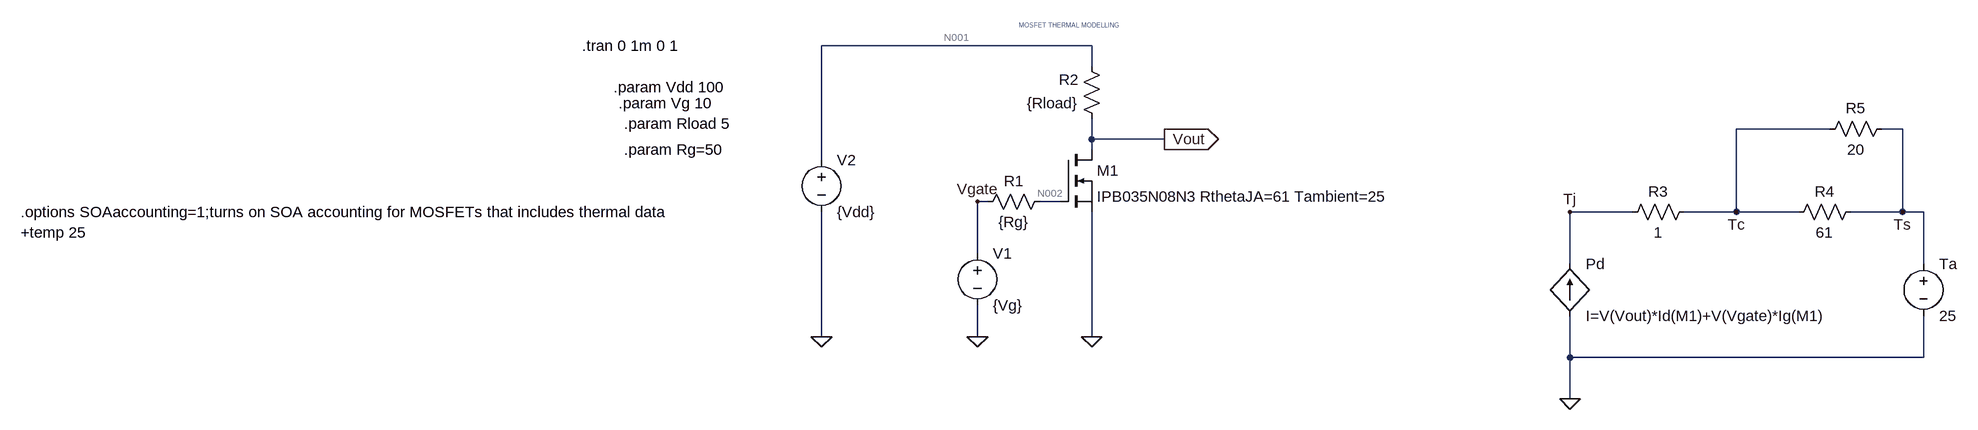
[diagram p0: schematic Thermal.asc]
Thermal.asc, the LTspice schematic file:
Version 4.1
SHEET 1 1416 680
WIRE 80 -48 -336 -48
WIRE 80 -16 80 -48
WIRE 1216 80 1072 80
WIRE 1328 80 1296 80
WIRE 80 96 80 64
WIRE 192 96 80 96
WIRE 80 112 80 96
WIRE -336 128 -336 -48
WIRE -80 192 -96 192
WIRE 32 192 0 192
WIRE 912 208 816 208
WIRE 1072 208 1072 80
WIRE 1072 208 992 208
WIRE 1168 208 1072 208
WIRE 1328 208 1328 80
WIRE 1328 208 1248 208
WIRE 1360 208 1328 208
WIRE -96 272 -96 192
WIRE 816 288 816 208
WIRE 1360 288 1360 208
WIRE -336 400 -336 208
WIRE -96 400 -96 352
WIRE 80 400 80 208
WIRE 816 432 816 368
WIRE 1360 432 1360 368
WIRE 1360 432 816 432
WIRE 816 496 816 432
FLAG -336 400 0
FLAG -96 400 0
FLAG 80 400 0
FLAG 192 96 Vout
IOPIN 192 96 Out
FLAG 816 496 0
FLAG 816 208 Tj
FLAG 1072 208 Tc
FLAG 1328 208 Ts
FLAG -96 192 Vgate
SYMBOL res 16 176 R90
WINDOW 0 0 56 VBottom 2
WINDOW 3 32 56 VTop 2
SYMATTR InstName R1
SYMATTR Value {Rg}
SYMBOL nmos 32 112 R0
SYMATTR InstName M1
SYMATTR Value IPB035N08N3 RthetaJA=61 Tambient=25
SYMBOL voltage -96 256 R0
SYMATTR InstName V1
SYMATTR Value {Vg}
SYMBOL voltage -336 112 R0
SYMATTR InstName V2
SYMATTR Value {Vdd}
SYMBOL res 96 80 R180
WINDOW 0 36 76 Left 2
WINDOW 3 36 40 Left 2
SYMATTR InstName R2
SYMATTR Value {Rload}
SYMBOL res 1008 192 R90
WINDOW 0 0 56 VBottom 2
WINDOW 3 32 56 VTop 2
SYMATTR InstName R3
SYMATTR Value 1
SYMBOL res 1264 192 R90
WINDOW 0 0 56 VBottom 2
WINDOW 3 32 56 VTop 2
SYMATTR InstName R4
SYMATTR Value 61
SYMBOL voltage 1360 272 R0
WINDOW 123 0 0 Left 0
WINDOW 39 0 0 Left 0
SYMATTR InstName Ta
SYMATTR Value 25
SYMBOL bi2 816 288 R0
SYMATTR InstName Pd
SYMATTR Value I=V(Vout)*Id(M1)+V(Vgate)*Ig(M1)
SYMBOL res 1312 64 R90
WINDOW 0 0 56 VBottom 2
WINDOW 3 32 56 VTop 2
SYMATTR InstName R5
SYMATTR Value 20
TEXT -32 -80 Left 0 ;MOSFET THERMAL MODELLING
TEXT -656 16 Left 2 !.param Vdd 100
TEXT -648 40 Left 2 !.param Vg 10
TEXT -640 72 Left 2 !.param Rload 5
TEXT -640 112 Left 2 !.param Rg=50
TEXT -704 -48 Left 2 !.tran 0 1m 0 1
TEXT -1568 208 Left 2 !.options SOAaccounting=1;turns on SOA accounting for MOSFETs that includes thermal data\n+temp 25

The netlist it stands for:
* Thermal.asc
R1 N002 Vgate {Rg}
M1 Vout N002 0 0 IPB035N08N3 RthetaJA=61 Tambient=25
V1 Vgate 0 {Vg}
V2 N001 0 {Vdd}
R2 Vout N001 {Rload}
R3 Tc Tj 1
R4 Ts Tc 61
V§Ta Ts 0 25
B§Pd 0 Tj I=V(Vout)*Id(M1)+V(Vgate)*Ig(M1)
R5 Ts Tc 20
.model NMOS NMOS
.model PMOS PMOS
.lib standard.mos
* MOSFET THERMAL MODELLING
.param Vdd 100
.param Vg 10
.param Rload 5
.param Rg=50
.tran 0 1m 0 1
.options SOAaccounting=1;turns on SOA accounting for MOSFETs that includes thermal data
+temp 25
.backanno
.end

* Results of the author's LTspice run, read from the files saved beside the schematic
* Operating Point, zero values left out:
*   V(n001) = 100 V
*   V(n002) = 10 V
*   V(tc) = 41.62 V
*   V(tj) = 42.72 V
*   V(ts) = 25 V
*   V(vgate) = 10 V
*   V(vout) = 55.2 mV
*   I(Pd) = 1.103 A
*   I(R2) = -19.99 A
*   I(R3) = -1.103 A
*   I(R4) = -272.4 mA
*   I(R5) = -830.9 mA
*   I(Ta) = 1.103 A
*   I(V2) = -19.99 A
*   Id(M1) = 19.99 A
*   Is(M1) = -19.99 A